# Altium schematic sheet Triangle VCO.SchDoc
size A3; SheetNumber: 4; SheetTotal: 4
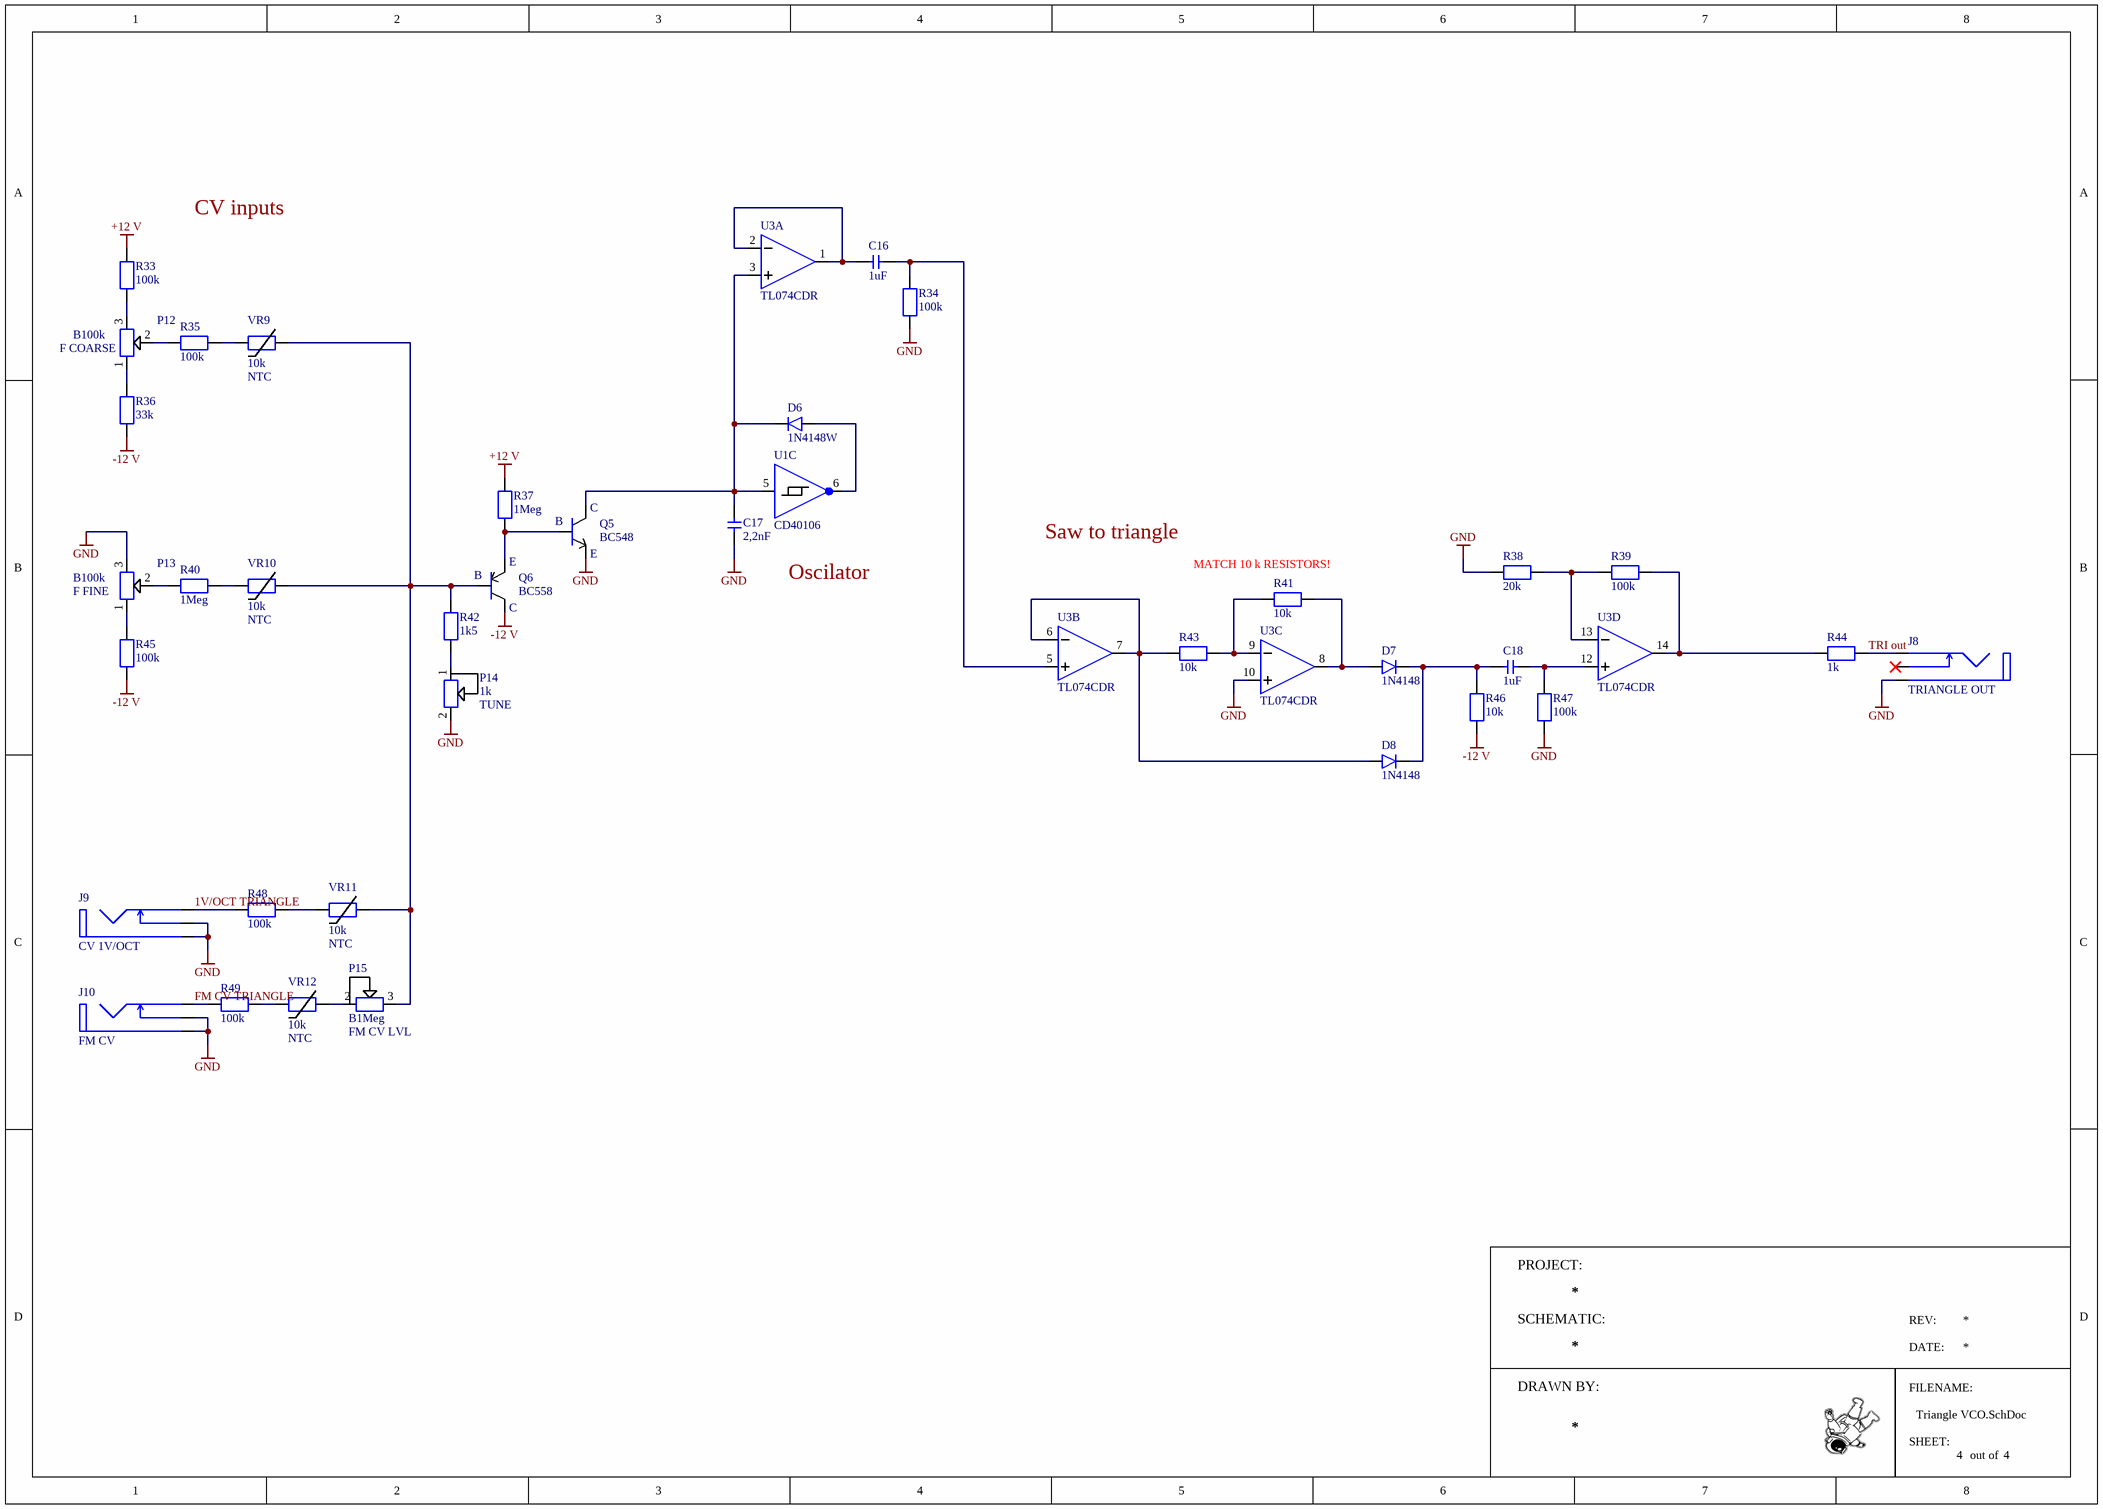
[diagram p0: Triangle VCO.SchDoc]

## Parts
C16  value 1uF  [Cap SMD 0805]  (hidden comment: CAP)
C17  value 2,2nF  [Cap SMD 0805]  (hidden comment: CAP)
C18  value 1uF  [Cap SMD 0805]  (hidden comment: CAP)
D6  Model: 1N4148W  [SOD-123]  (hidden comment: DIODE)
D7  Model: 1N4148  [Diode THT 10 mm]  (hidden comment: DIODE)
D8  Model: 1N4148  [Diode THT 10 mm]  (hidden comment: DIODE)
J8  Label: TRIANGLE OUT  [PJ301M]  (hidden comment: JACK Mono)
J9  Label: CV 1V/OCT  [PJ301M]  (hidden comment: JACK Mono)
J10  Label: FM CV  [PJ301M]  (hidden comment: JACK Mono)
P12  value B100k  Parameter: F COARSE  [9 mm PCB Potentiometer]  (hidden comment: Mono Pot)
P13  value B100k  Parameter: F FINE  [9 mm PCB Potentiometer]  (hidden comment: Mono Pot)
P14  value 1k  Parameter: TUNE  [Multiturn Potentiometer inline]  (hidden comment: VR)
P15  value B1Meg  Parameter: FM CV LVL  [9 mm PCB Potentiometer]  (hidden comment: VR)
Q5  BC548  [TO-92 wide]
Q6  BC558  [TO-92 wide]
R33  value 100k  [Resistor SMD 0805]  (hidden comment: RES)
R34  value 100k  [Resistor SMD 0805]  (hidden comment: RES)
R35  value 100k  [Resistor SMD 0805]  (hidden comment: RES)
R36  value 33k  [Resistor SMD 0805]  (hidden comment: RES)
R37  value 1Meg  [Resistor SMD 0805]  (hidden comment: RES)
R38  value 20k  [Resistor SMD 0805]  (hidden comment: RES)
R39  value 100k  [Resistor SMD 0805]  (hidden comment: RES)
R40  value 1Meg  [Resistor SMD 0805]  (hidden comment: RES)
R41  value 10k  [Resistor THT vertical]  (hidden comment: RES)
R42  value 1k5  [Resistor SMD 0805]  (hidden comment: RES)
R43  value 10k  [Resistor THT vertical]  (hidden comment: RES)
R44  value 1k  [Resistor SMD 0805]  (hidden comment: RES)
R45  value 100k  [Resistor SMD 0805]  (hidden comment: RES)
R46  value 10k  [Resistor SMD 0805]  (hidden comment: RES)
R47  value 100k  [Resistor SMD 0805]  (hidden comment: RES)
R48  value 100k  [Resistor SMD 0805]  (hidden comment: RES)
R49  value 100k  [Resistor SMD 0805]  (hidden comment: RES)
U1  CD40106  [DIP-14 socket]  (part C of 7)
U3  TL074CDR  [SOIC14]  (parts A,B,C,D of 5)
VR9  NTC  value 10k  [Thermistor SMD 0805]
VR10  NTC  value 10k  [Thermistor SMD 0805]
VR11  NTC  value 10k  [Thermistor SMD 0805]
VR12  NTC  value 10k  [Thermistor SMD 0805]

## Nets
+12 V: R33.2 R37.1
-12 V: Q6.1 R36.1 R45.1 R46.2
GND: C17.1 J8.1 J9.1 J9.2 J10.1 J10.2 P13.3 P14.2 Q5.3 R34.2 R38.1 R47.2 U3.10
1V/OCT TRIANGLE: J9.3 R48.2
FM CV TRIANGLE: J10.3 R49.2
TRI out: J8.3 R44.2
NetC16_1: C16.1 R34.1 U3.5
NetC16_2: C16.2 U3.1 U3.2
NetC17_2: C17.2 D6.2 Q5.1 U1.5 U3.3
NetC18_1: C18.1 R47.1 U3.12
NetC18_2: C18.2 D7.2 D8.2 R46.1
NetD6_1: D6.1 U1.6
NetD7_1: D7.1 R41.2 U3.8
NetD8_1: D8.1 R43.1 U3.6 U3.7
NetP12_1: P12.1 R36.2
NetP12_2: P12.2 R35.2
NetP12_3: P12.3 R33.1
NetP13_1: P13.1 R45.2
NetP13_2: P13.2 R40.2
NetP14_1: P14.1 R42.2
NetP15_2: P15.2 VR12.2
NetP15_3: P15.3 Q6.2 R42.1 VR9.2 VR10.2 VR11.2
NetQ5_2: Q5.2 Q6.3 R37.2
NetR35_1: R35.1 VR9.1
NetR38_2: R38.2 R39.1 U3.13
NetR39_2: R39.2 R44.1 U3.14
NetR40_1: R40.1 VR10.1
NetR41_1: R41.1 R43.2 U3.9
NetR48_1: R48.1 VR11.1
NetR49_1: R49.1 VR12.1

Not connected (* = marked no-connect by the designer): J8 2*

## Notes on the sheet
- CV inputs
- Oscilator
- Saw to triangle
- (near R41) MATCH 10 k RESISTORS!
- PROJECT:
- SCHEMATIC:
- REV:
- DRAWN BY:
- DATE:
- FILENAME:
- SHEET:
- out of
- (in symbol BC548) C; B; E
- (in symbol BC558) E; B; C

## Library data of the parts
C16-C18 = Capacitor SMD 0805: SMD Capacitor Non-Polarised 0805 Package; Voltage rating: *; Tolerance: *; Package Type: SMD
D6 = Diode SMD SOD123: Generic SMD Diode SOD123 Package; Max reverse voltage: *; Max current: *; Forward voltage: *; Package Type: SMD; Type: Diode
D7 D8 = Diode THT: Generic THT Axial Diode 10 mm Pitch; Max reverse voltage: *; Max current: *; Forward voltage: *; Package Type: THT; Type: Diode
J8-J10 = PJ301M: PJ301M Eurorack 3,5 mm Patch Socket PCB Mount; Package Type: THT
P12 P13 = Potentiometer 9 mm: PCB Mount 9mm Mono Potentiometer THT; Taper: *; Package Type: THT; Type: Potentiometer
P14 = VR A Multiturn THT: PCB Mount Multiturn Trimmer Potentiometer Top Adjustable as Variable Resistor Clockwise Increase; Taper: *; Package Type: THT; Type: Potentiometer
P15 = VR B 9 mm: PCB Mount 9mm Mono Potentiometer THT as Variable Resistor Clockwise Decrease; Taper: *; Package Type: THT; Type: Potentiometer
Q5 = BC548: BC548 NPN Transistor THT TO-92 Package; Package Type: THT; Type: NPN Transistor; Package: TO-92; Group: *
Q6 = BC558: BC558 PNP Transistor THT TO-92 Package; Package Type: THT; Type: PNP Transistor; Package: TO-92; Group: *
R33-R40 R42 R44-R49 = Resistor SMD 0805: SMD Resistor 0805 package; Tolerance: *; Package Type: SMD
R41 R43 = Resistor THT: THT Axial Resistor 10mm Pitch; Tolerance: *; Package Type: THT
U1 = CD40106 DIP-14: CD40106 Hex Schmitt Trigger Inverter DIP-14 Package; Type: Schmitt Trigger; Package Type: THT; Package: DIP-14
U3 = TL074CDR SOIC14: TL074CDR Quad Op-Amp SOIC14 Package; Type: Op Amp; Package Type: SMD; Package: SOIC14
VR9-VR12 = Thermistor NTC SMD 0805: SMD NTC Thermistor 0805 package; Tolerance: *; Package Type: SMD